# EasyEDA schematic schematic_v1.json
TITLE: Sheet_1; REV: 1.0; Date: 2023-08-14; Sheet: 1/1; Drawn By: 65011005; Company: Your Company
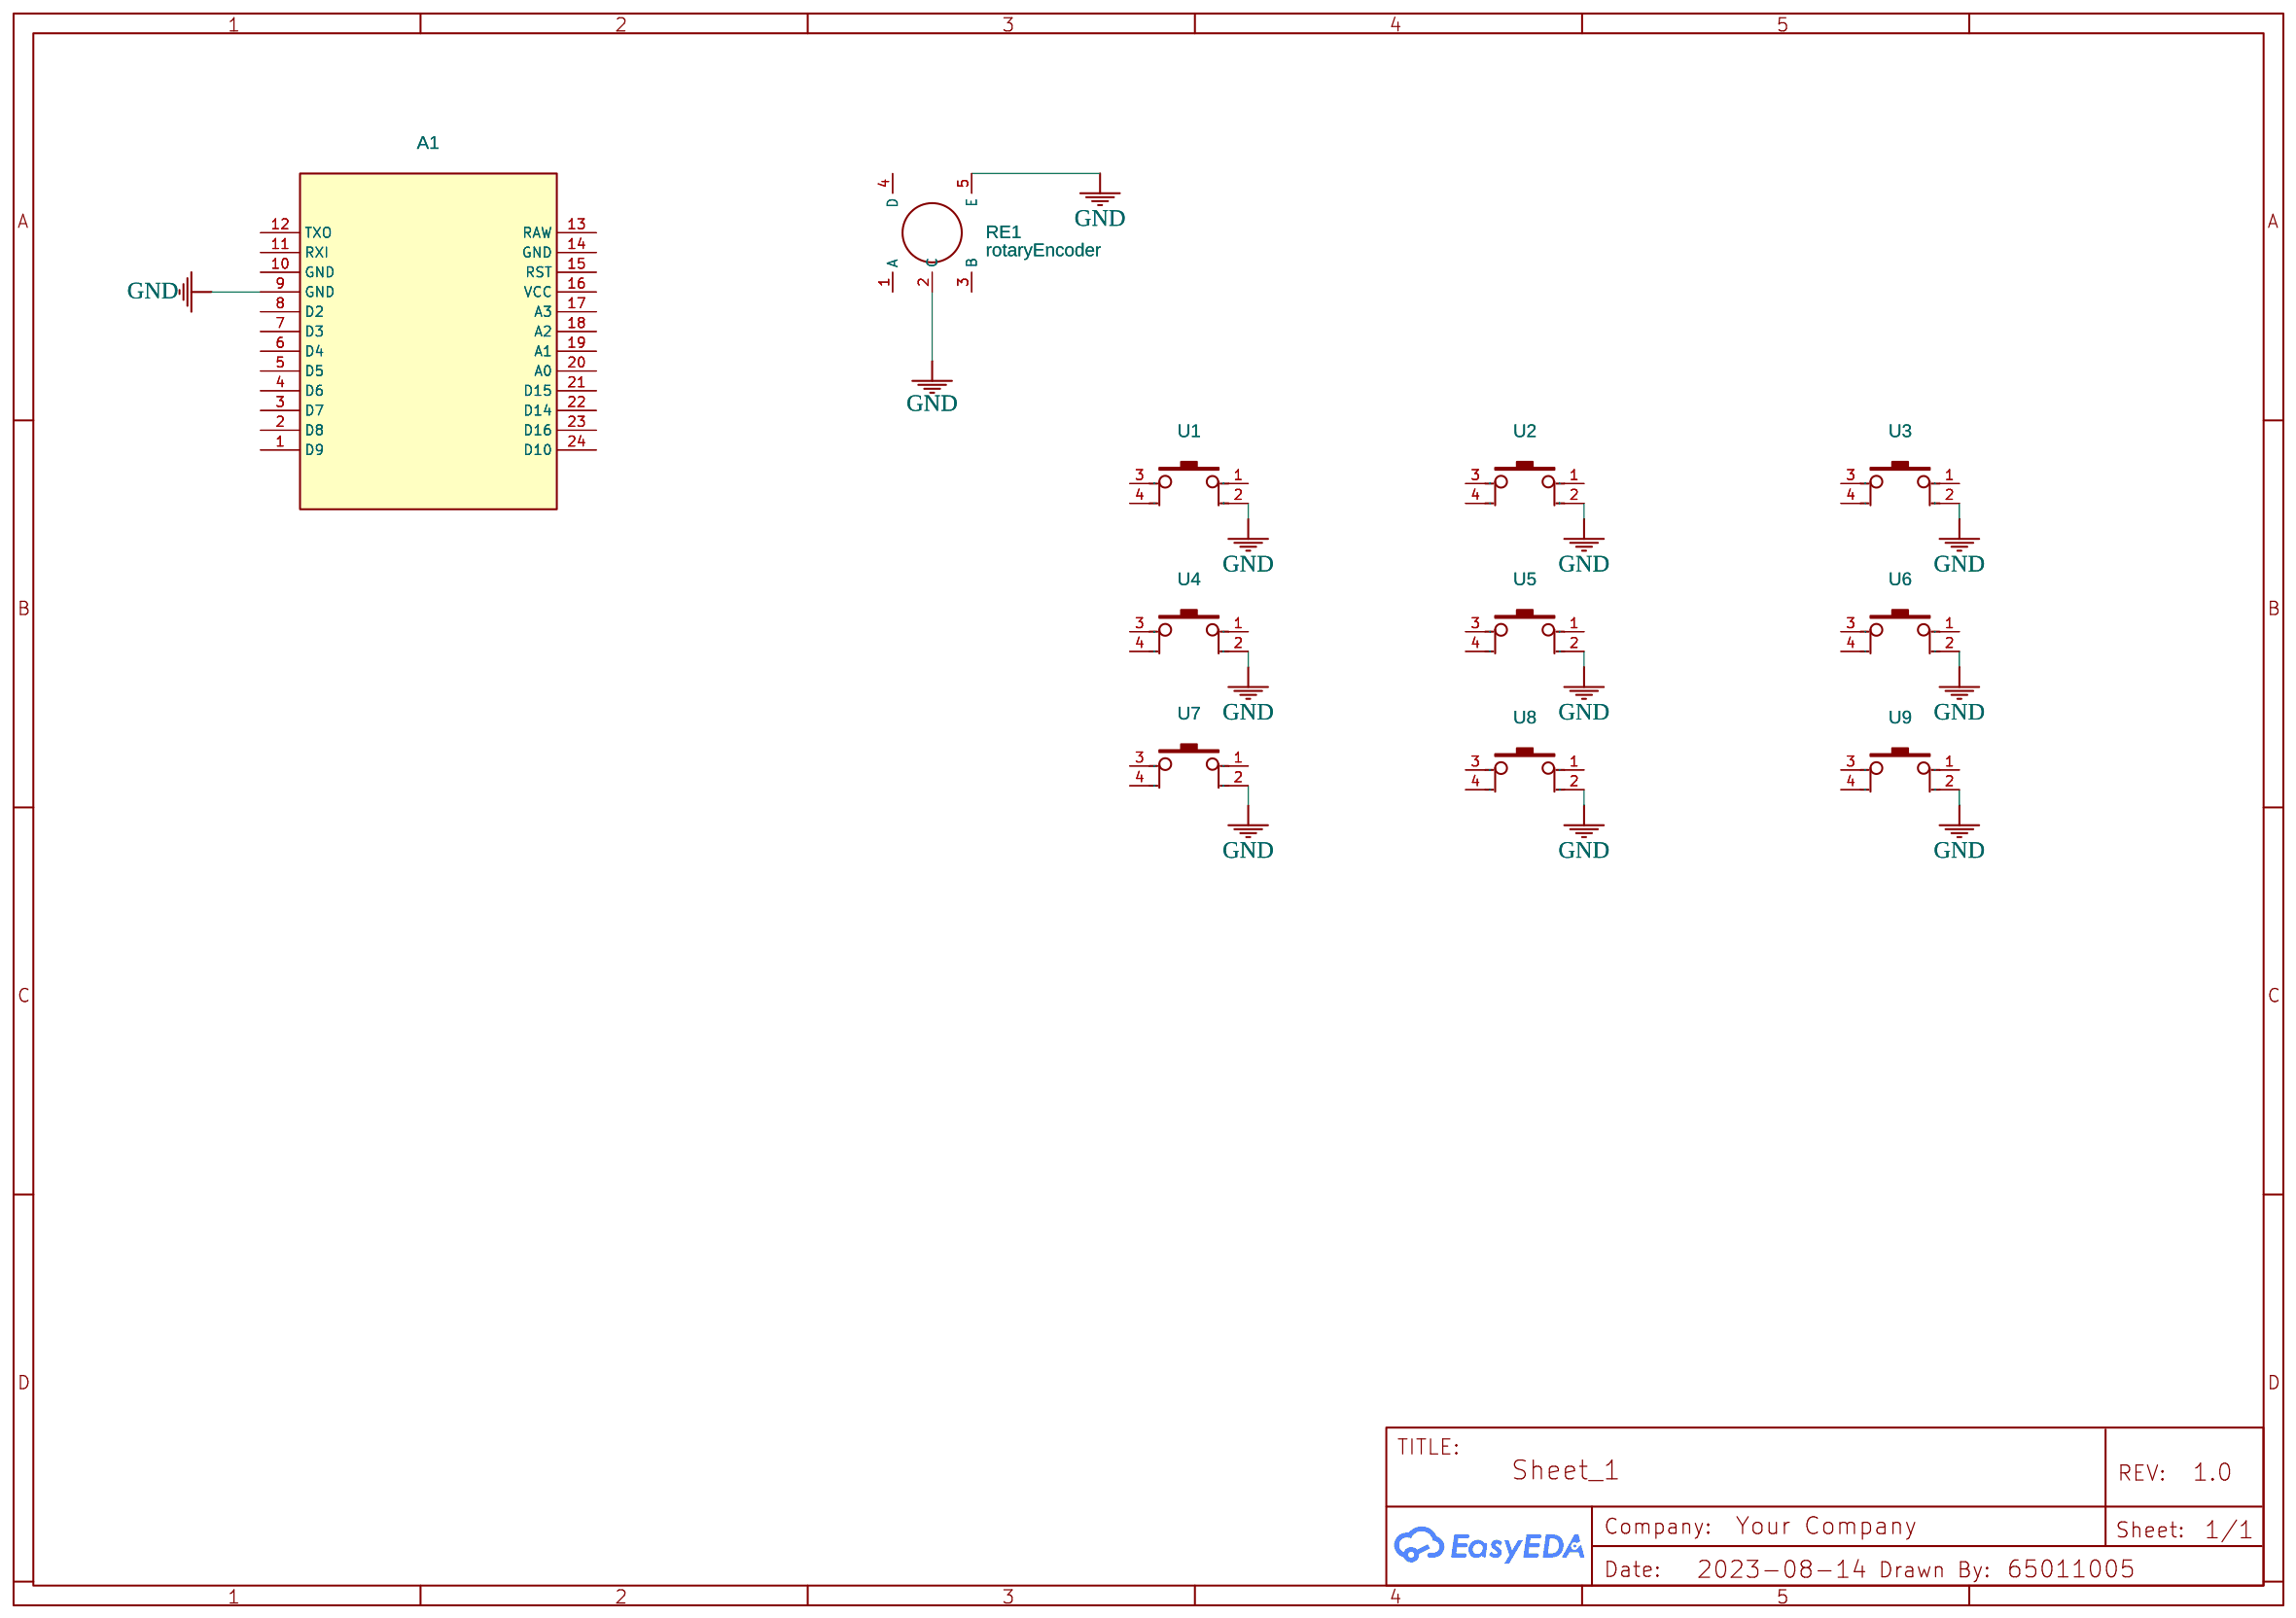
[diagram p0: schematic sheet]

## Parts
A1  NO  [PRO MICRO - 5V]
RE1  rotaryEncoder  [ROTARYENCODER]
U1  NO  [10MM PUSHBUTTON SWITCH]
U2  NO  [10MM PUSHBUTTON SWITCH]
U3  NO  [10MM PUSHBUTTON SWITCH]
U4  NO  [10MM PUSHBUTTON SWITCH]
U5  NO  [10MM PUSHBUTTON SWITCH]
U6  NO  [10MM PUSHBUTTON SWITCH]
U7  NO  [10MM PUSHBUTTON SWITCH]
U8  NO  [10MM PUSHBUTTON SWITCH]
U9  NO  [10MM PUSHBUTTON SWITCH]

## Library data of the parts
A1 = Pro Micro - 5V: sourceId: 1T5FDZYC8
RE1 = rotaryEncoder: Contributor: manunle
U1-U9 = 10mm pushbutton switch: Contributor: TANNA

## Nets
GND: A1.9(GND) RE1.2(C) RE1.5(E) U1.2 U2.2 U3.2 U4.2 U5.2 U6.2 U7.2 U8.2 U9.2

Not connected (* = marked no-connect by the designer): A1 1(D9) 2(D8) 3(D7) 4(D6) 5(D5) 6(D4) 7(D3) 8(D2) 10(GND) 11(RXI) 12(TXO) 13(RAW) 14(GND) 15(RST) 16(VCC) 17(A3) 18(A2) 19(A1) 20(A0) 21(D15) 22(D14) 23(D16) 24(D10); RE1 1(A) 3(B) 4(D); U1 1 3 4; U2 1 3 4; U3 1 3 4; U4 1 3 4; U5 1 3 4; U6 1 3 4; U7 1 3 4; U8 1 3 4; U9 1 3 4
